# EAGLE design DINRaspberry (EAGLE 6.5.0)
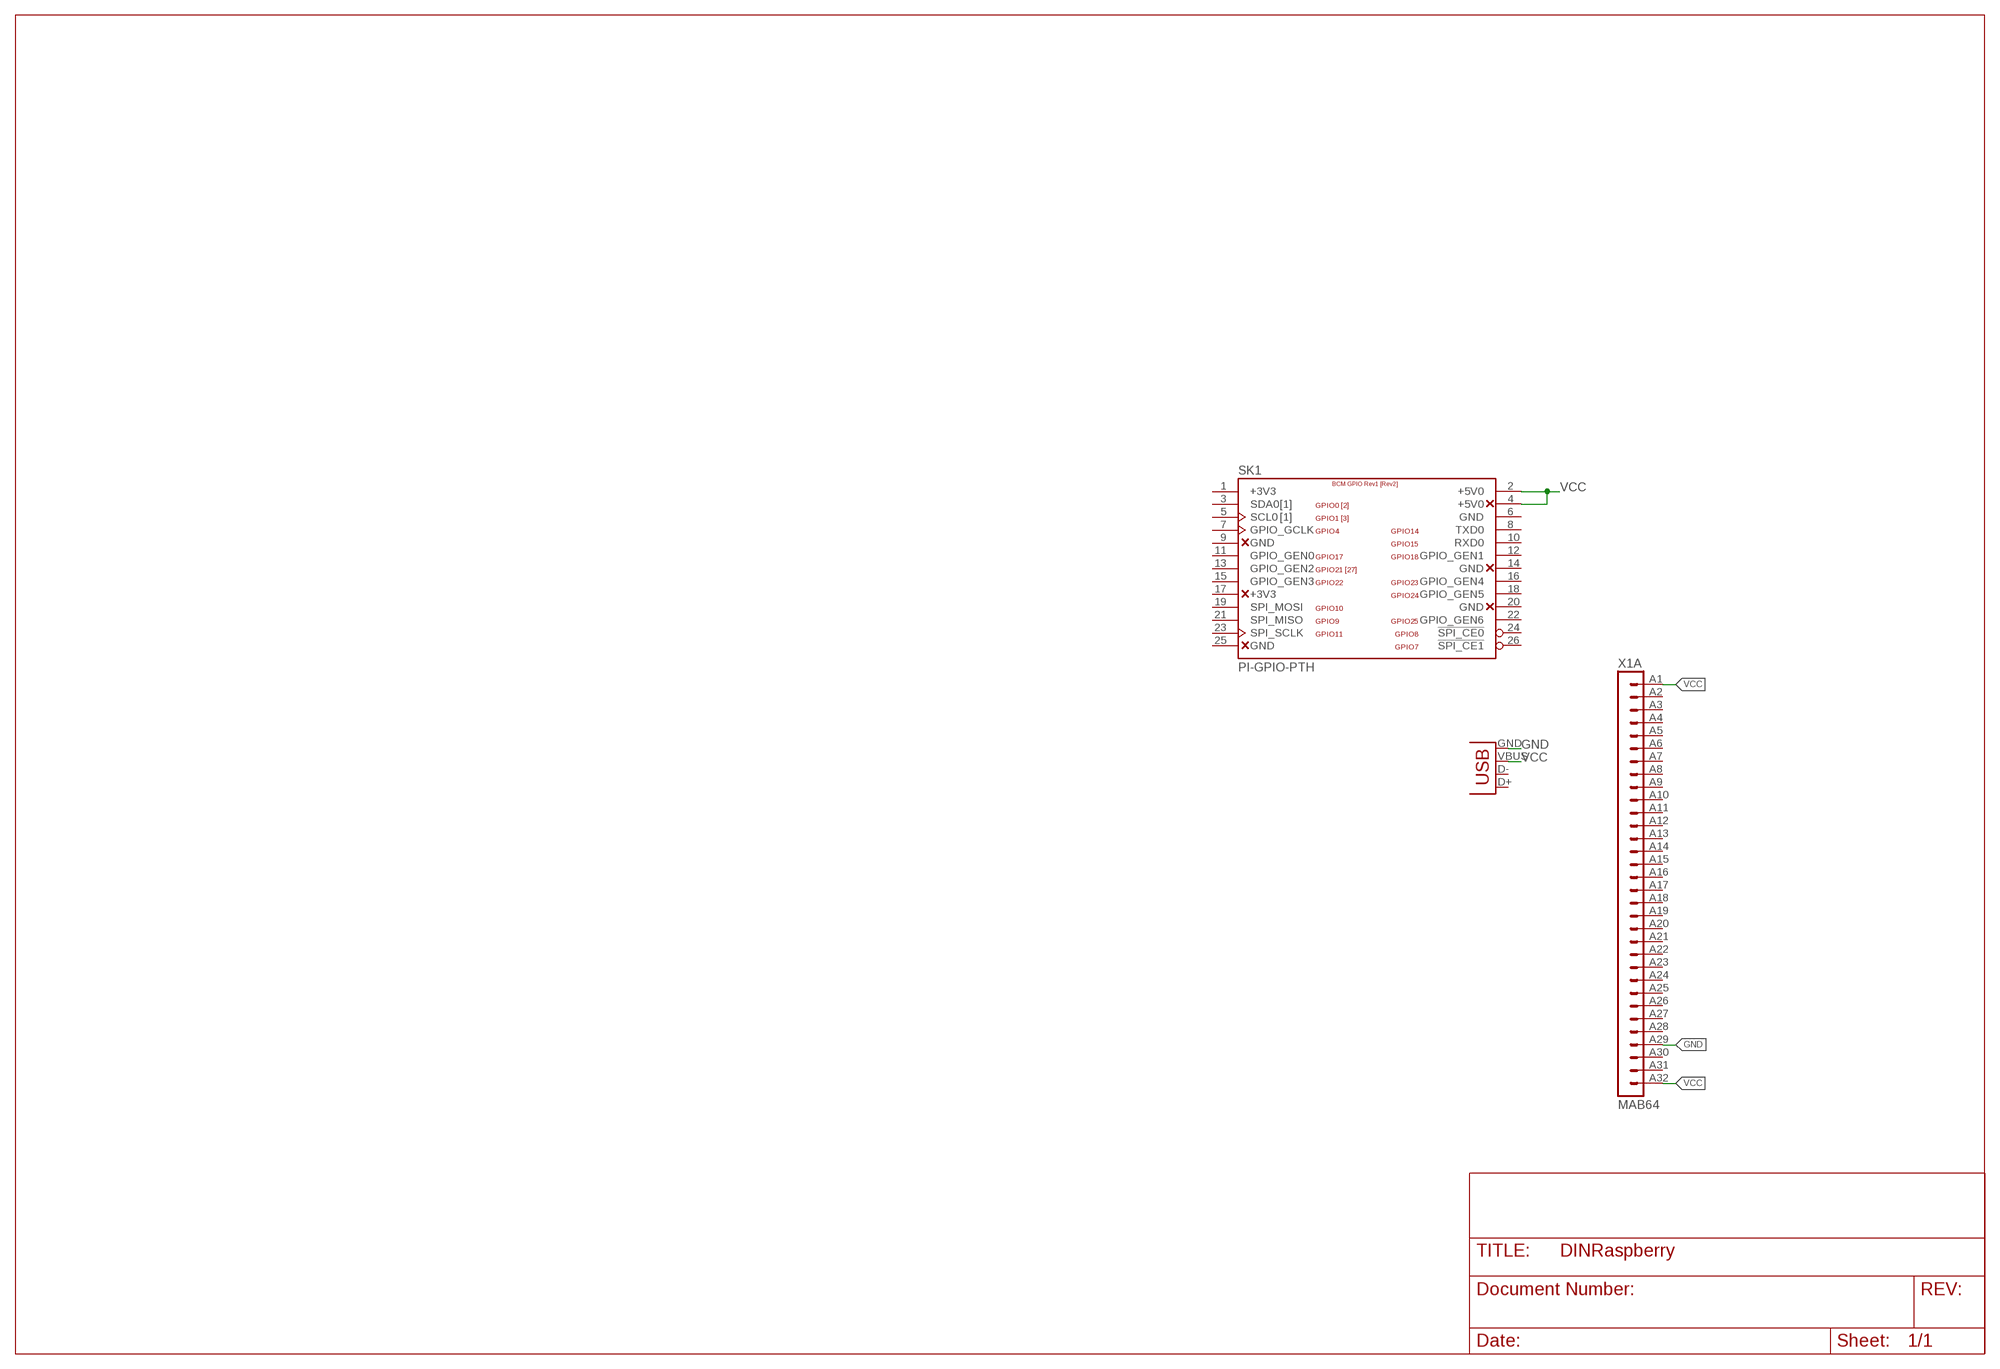
[diagram p0: schematic, sheet 1]

## Parts
SK1  PI-GPIO-PTH  [GPIO-CONNECTOR]
X1  MAB64  [MAB64]
X2  USBPTH  [USB-B-PTH]

## Nets
GND [Gnd]: X1.A29 X2.GND
VCC [Vcc]: SK1.2(+5V0) SK1.4(+5V0) X1.A1 X1.A32 X2.VBUS
Unconnected: SK1.3(SDA0) SK1.5(SCL0) SK1.7(GPIO_GCLK) SK1.8(TXD0) SK1.9(GND) SK1.10(RXD0) SK1.11(GPIO_GEN0) SK1.12(GPIO_GEN1) SK1.13(GPIO_GEN2) SK1.14(GND) SK1.15(GPIO_GEN3) SK1.16(GPIO_GEN4) SK1.17(+3V3) SK1.18(GPIO_GEN5) SK1.19(SPI_MOSI) SK1.20(GND) SK1.21(SPI_MISO) SK1.22(GPIO_GEN6) SK1.23(SPI_SCLK) SK1.24(!SPI_CE0) SK1.25(GND) SK1.26(!SPI_CE1) X1.A2 X1.A3 X1.A4 X1.A5 X1.A6 X1.A7 X1.A8 X1.A9 X1.A10 X1.A11 X1.A12 X1.A13 X1.A14 X1.A15 X1.A16 X1.A17 X1.A18 X1.A19 X1.A20 X1.A21 X1.A22 X1.A23 X1.A24 X1.A25 X1.A26 X1.A27 X1.A28 X1.A30 X1.A31 X1.B1 X1.B2 X1.B3 X1.B4 X1.B5 X1.B6 X1.B7 X1.B8 X1.B9 X1.B10 X1.B11 X1.B12 X1.B13 X1.B14 X1.B15 X1.B16 X1.B17 X1.B18 X1.B19 X1.B20 X1.B21 X1.B22 X1.B23 X1.B24 X1.B25 X1.B26 X1.B27 X1.B28 X1.B29 X1.B30 X1.B31 X1.B32 X2.D+ X2.D-

## Power pins joined to a net without a drawn wire
+3V3: SK1.1(+3V3)
GND: SK1.6(GND)

## Library data of the parts
SK1 = jt-raspberry-pi:PI-: Raspberry Pi
X1 = con-vg:MAB64: CONNECTOR male, 94 pins, type B, rows AB, grid 2.54 mm
X2 = SparkFun:USB: USB Connectors USB-B-PTH is fully proven SKU : PRT-00139 USB-miniB is fully proven SKU : PRT-00587 USB-A-PCB is untested. USB-A-H is throughly reviewed, but untested. Spark Fun Electronics SKU : PRT-00437 USB-B-SMT is throughly reviewed, but untested. Needs silkscreen touching up. USB-A-S has not been used/tested USB-MB-H has not been used/tested

## Net classes
0 default: width 0.4 mm, clearance 0.254 mm
1 Vcc: width 0.406 mm, clearance 0.15 mm
2 Gnd: clearance 0.15 mm

## Board
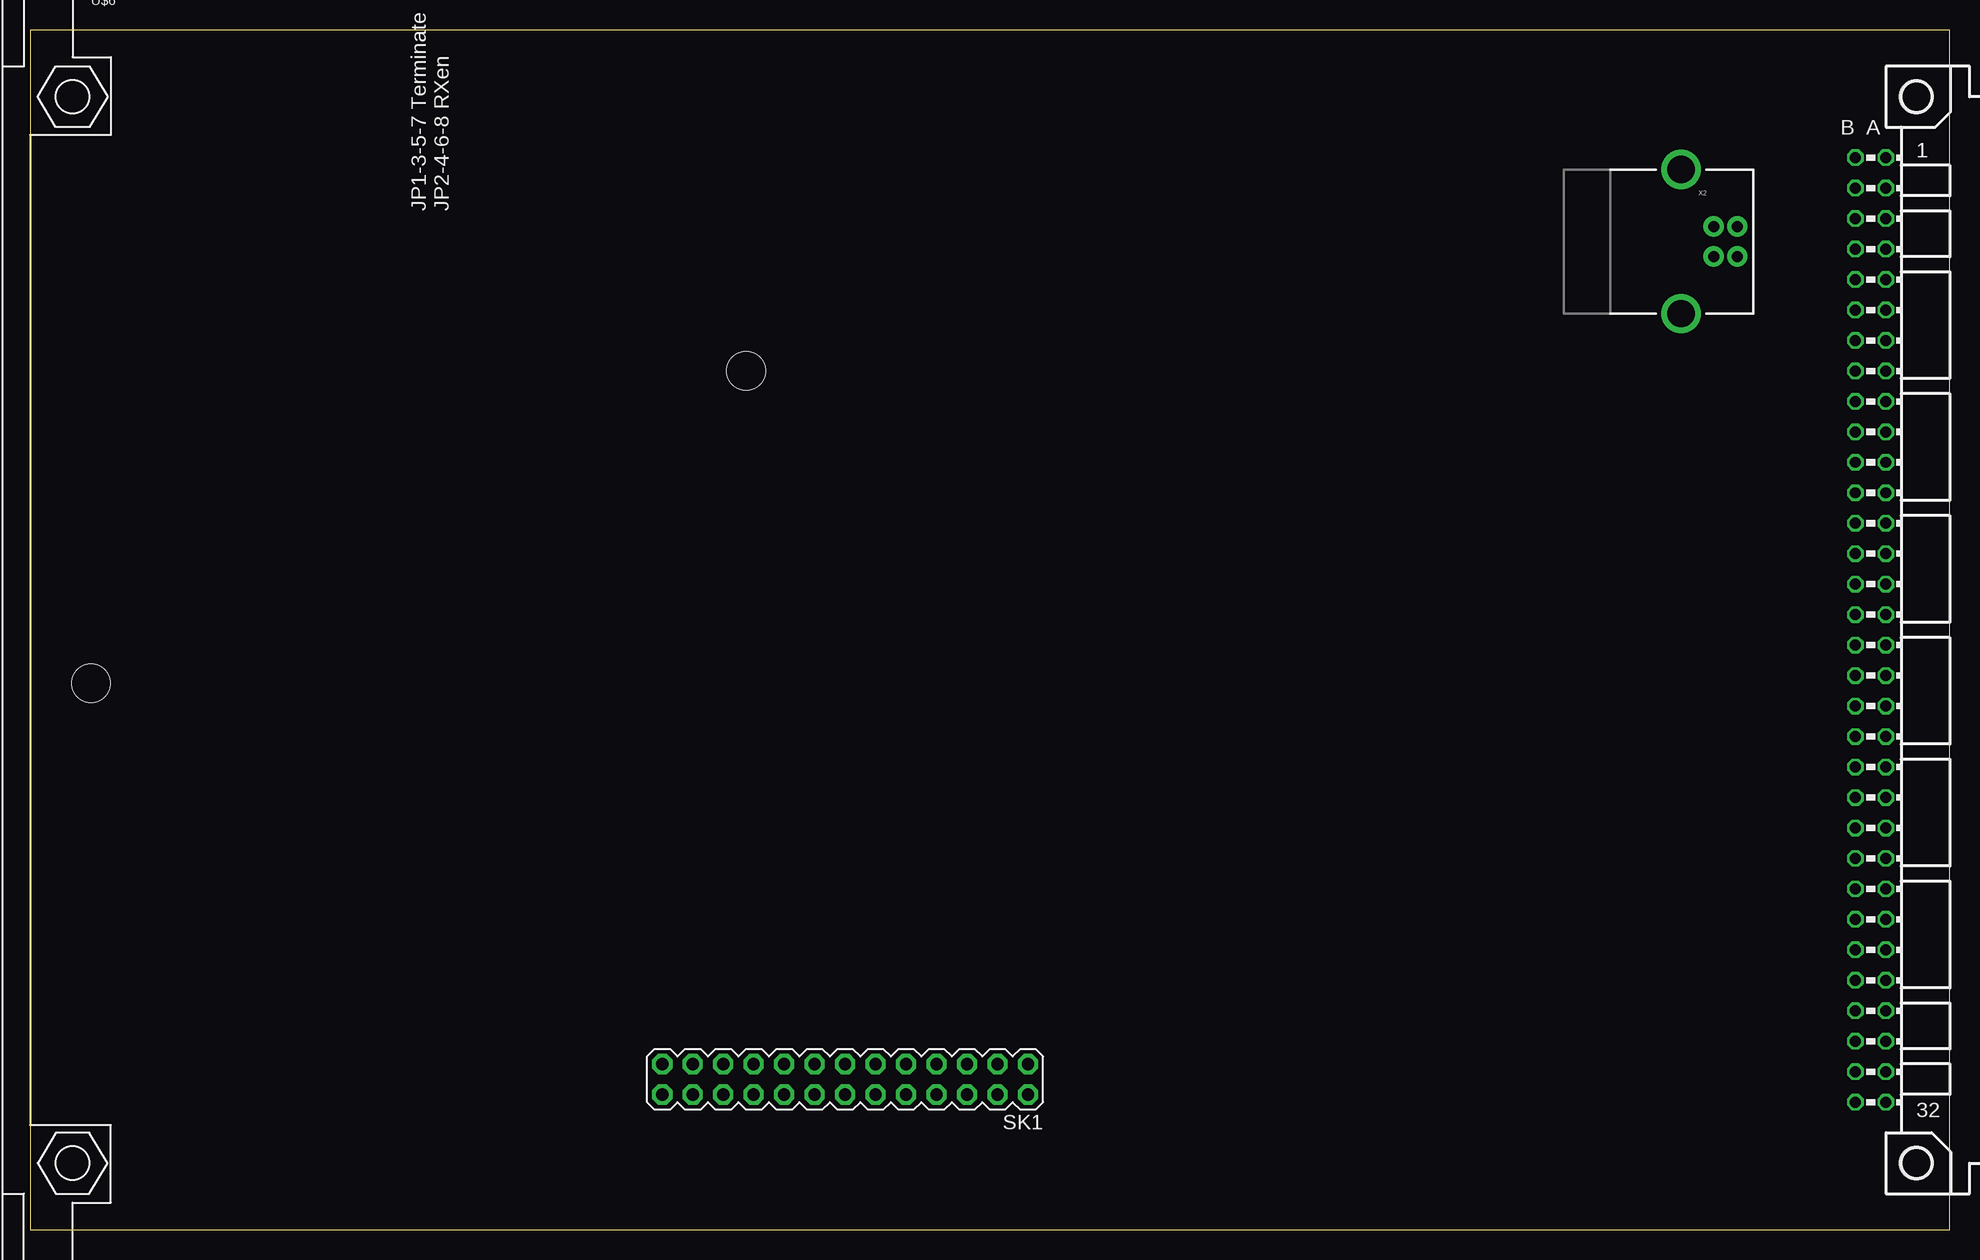
[diagram p1: board, top side]
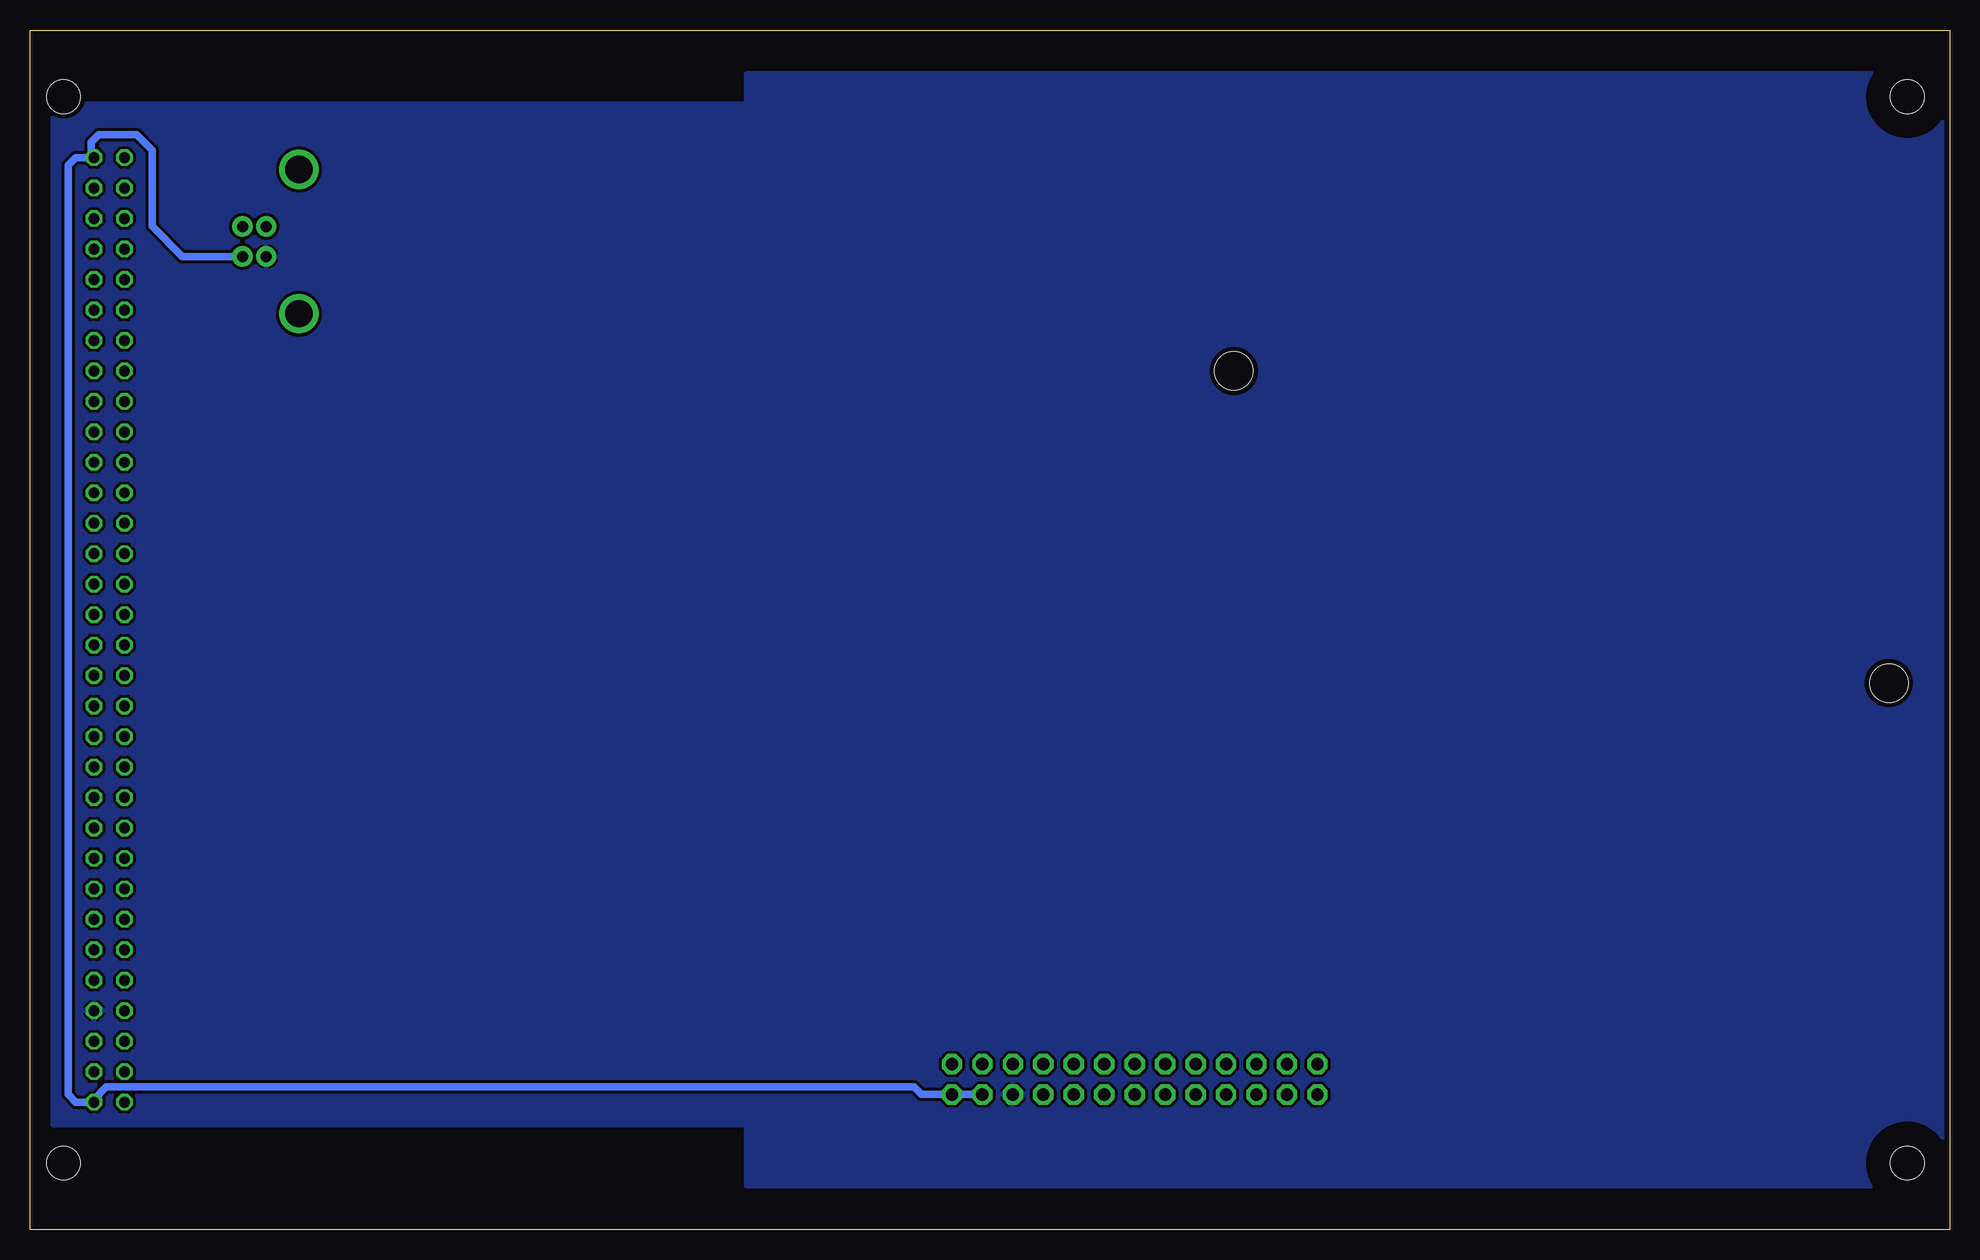
[diagram p2: board, bottom side, seen from below]

Size 160.03 x 100.03 mm. Coordinates in mm from the lower left corner, seen from the top.
Copper layers (1*16): Top 0.035mm / dielectric 1.5mm / Bottom 0.035mm
Design rules "pcb-devboards_35µmCU_200µm_Strukturen_Abstaende": minimum track width 0.2mm, minimum drill 0.3mm, track to track 0.2mm, track to pad 0.2mm, pad to pad 0.2mm, via to via 0.2mm, smd to smd 0.2mm, copper to edge 0.4mm, drill to drill 0.4mm, minimum pad ring 0.2mm, minimum via ring 0.2mm, stop-mask expansion 0.1mm, vias tented up to drill 0mil, thermal gap 0.2mm
Holes 3.2 mm at 59.69,71.6 5.08,45.57

### Footprints (pad centres in the part's own frame; a part is rotated, then mirrored left to right if it is on the bottom)
GPIO-CONNECTOR = drill 1.016 pad 1.676 octagon: 1 -15.24,-1.27; 2 -15.24,1.27; 3 -12.7,-1.27; 4 -12.7,1.27; 5 -10.16,-1.27; 6 -10.16,1.27; 7 -7.62,-1.27; 8 -7.62,1.27; 9 -5.08,-1.27; 10 -5.08,1.27; 11 -2.54,-1.27; 12 -2.54,1.27; 13 0,-1.27; 14 0,1.27; 15 2.54,-1.27; 16 2.54,1.27; 17 5.08,-1.27; 18 5.08,1.27; 19 7.62,-1.27; 20 7.62,1.27; 21 10.16,-1.27; 22 10.16,1.27; 23 12.7,-1.27; 24 12.7,1.27; 25 15.24,-1.27; 26 15.24,1.27
EK-FP = hole 2.794: 3.556,44.45; 3.556,-44.45
MAB64 = drill 0.914 octagon: A1 -2.54,39.37; A2 -2.54,36.83; A3 -2.54,34.29; A4 -2.54,31.75; A5 -2.54,29.21; A6 -2.54,26.67; A7 -2.54,24.13; A8 -2.54,21.59; A9 -2.54,19.05; A10 -2.54,16.51; A11 -2.54,13.97; A12 -2.54,11.43; A13 -2.54,8.89; A14 -2.54,6.35; A15 -2.54,3.81; A16 -2.54,1.27; A17 -2.54,-1.27; A18 -2.54,-3.81; A19 -2.54,-6.35; A20 -2.54,-8.89; A21 -2.54,-11.43; A22 -2.54,-13.97; A23 -2.54,-16.51; A24 -2.54,-19.05; A25 -2.54,-21.59; A26 -2.54,-24.13; A27 -2.54,-26.67; A28 -2.54,-29.21; A29 -2.54,-31.75; A30 -2.54,-34.29; A31 -2.54,-36.83; A32 -2.54,-39.37; B1 -5.08,39.37; B2 -5.08,36.83; B3 -5.08,34.29; B4 -5.08,31.75; B5 -5.08,29.21; B6 -5.08,26.67; B7 -5.08,24.13; B8 -5.08,21.59; B9 -5.08,19.05; B10 -5.08,16.51; B11 -5.08,13.97; B12 -5.08,11.43; B13 -5.08,8.89; B14 -5.08,6.35; B15 -5.08,3.81; B16 -5.08,1.27; B17 -5.08,-1.27; B18 -5.08,-3.81; B19 -5.08,-6.35; B20 -5.08,-8.89; B21 -5.08,-11.43; B22 -5.08,-13.97; B23 -5.08,-16.51; B24 -5.08,-19.05; B25 -5.08,-21.59; B26 -5.08,-24.13; B27 -5.08,-26.67; B28 -5.08,-29.21; B29 -5.08,-31.75; B30 -5.08,-34.29; B31 -5.08,-36.83; B32 -5.08,-39.37 | hole 2.794: 0,44.45; 0,-44.45
USB-B-PTH = drill 0.914 pad 1.676: D+ 0,1.25; D- 1.981,1.25; GND 0,-1.25; VBUS 1.981,-1.25 | drill 2.286: S1 -2.718,-6.02; S2 -2.718,6.02

### Placement (x,y rotation side)
SK1  67.95,12.55 180 top
U$6  [EK-FP]  0,50.01 0 top
X1  157.23,50.01 0 top
X2  140.34,82.4 0 top

### Tracks (layer width: path | path; a pad name or v marks a point on that pad's centre or on a via)
GND
  pour Bottom (isolate 0.254): 0.63,3.66 0.63,96.37 100.33,96.37 100.33,93.83 158.12,93.83 158.12,8.74 100.33,8.74 100.33,3.66
VCC
  Bottom 0.61: SK1.4 SK1.2 85.73,11.28 86.36,11.91 153.67,11.91 154.69,10.89 X1.A32 156.21,10.64 156.84,11.28 156.84,88.75 156.21,89.38 X1.A1 | X1.A1 | X2.VBUS 147.34,81.15 149.86,83.67 149.86,90.02 151.13,91.29 154.31,91.29 154.94,90.65 154.94,89.63 X1.A1

### Text on the board
tNames: JP1-3-5-7 Terminate | JP2-4-6-8 RXen